# EAGLE design sensor_final_v1 (EAGLE 9.6.2)
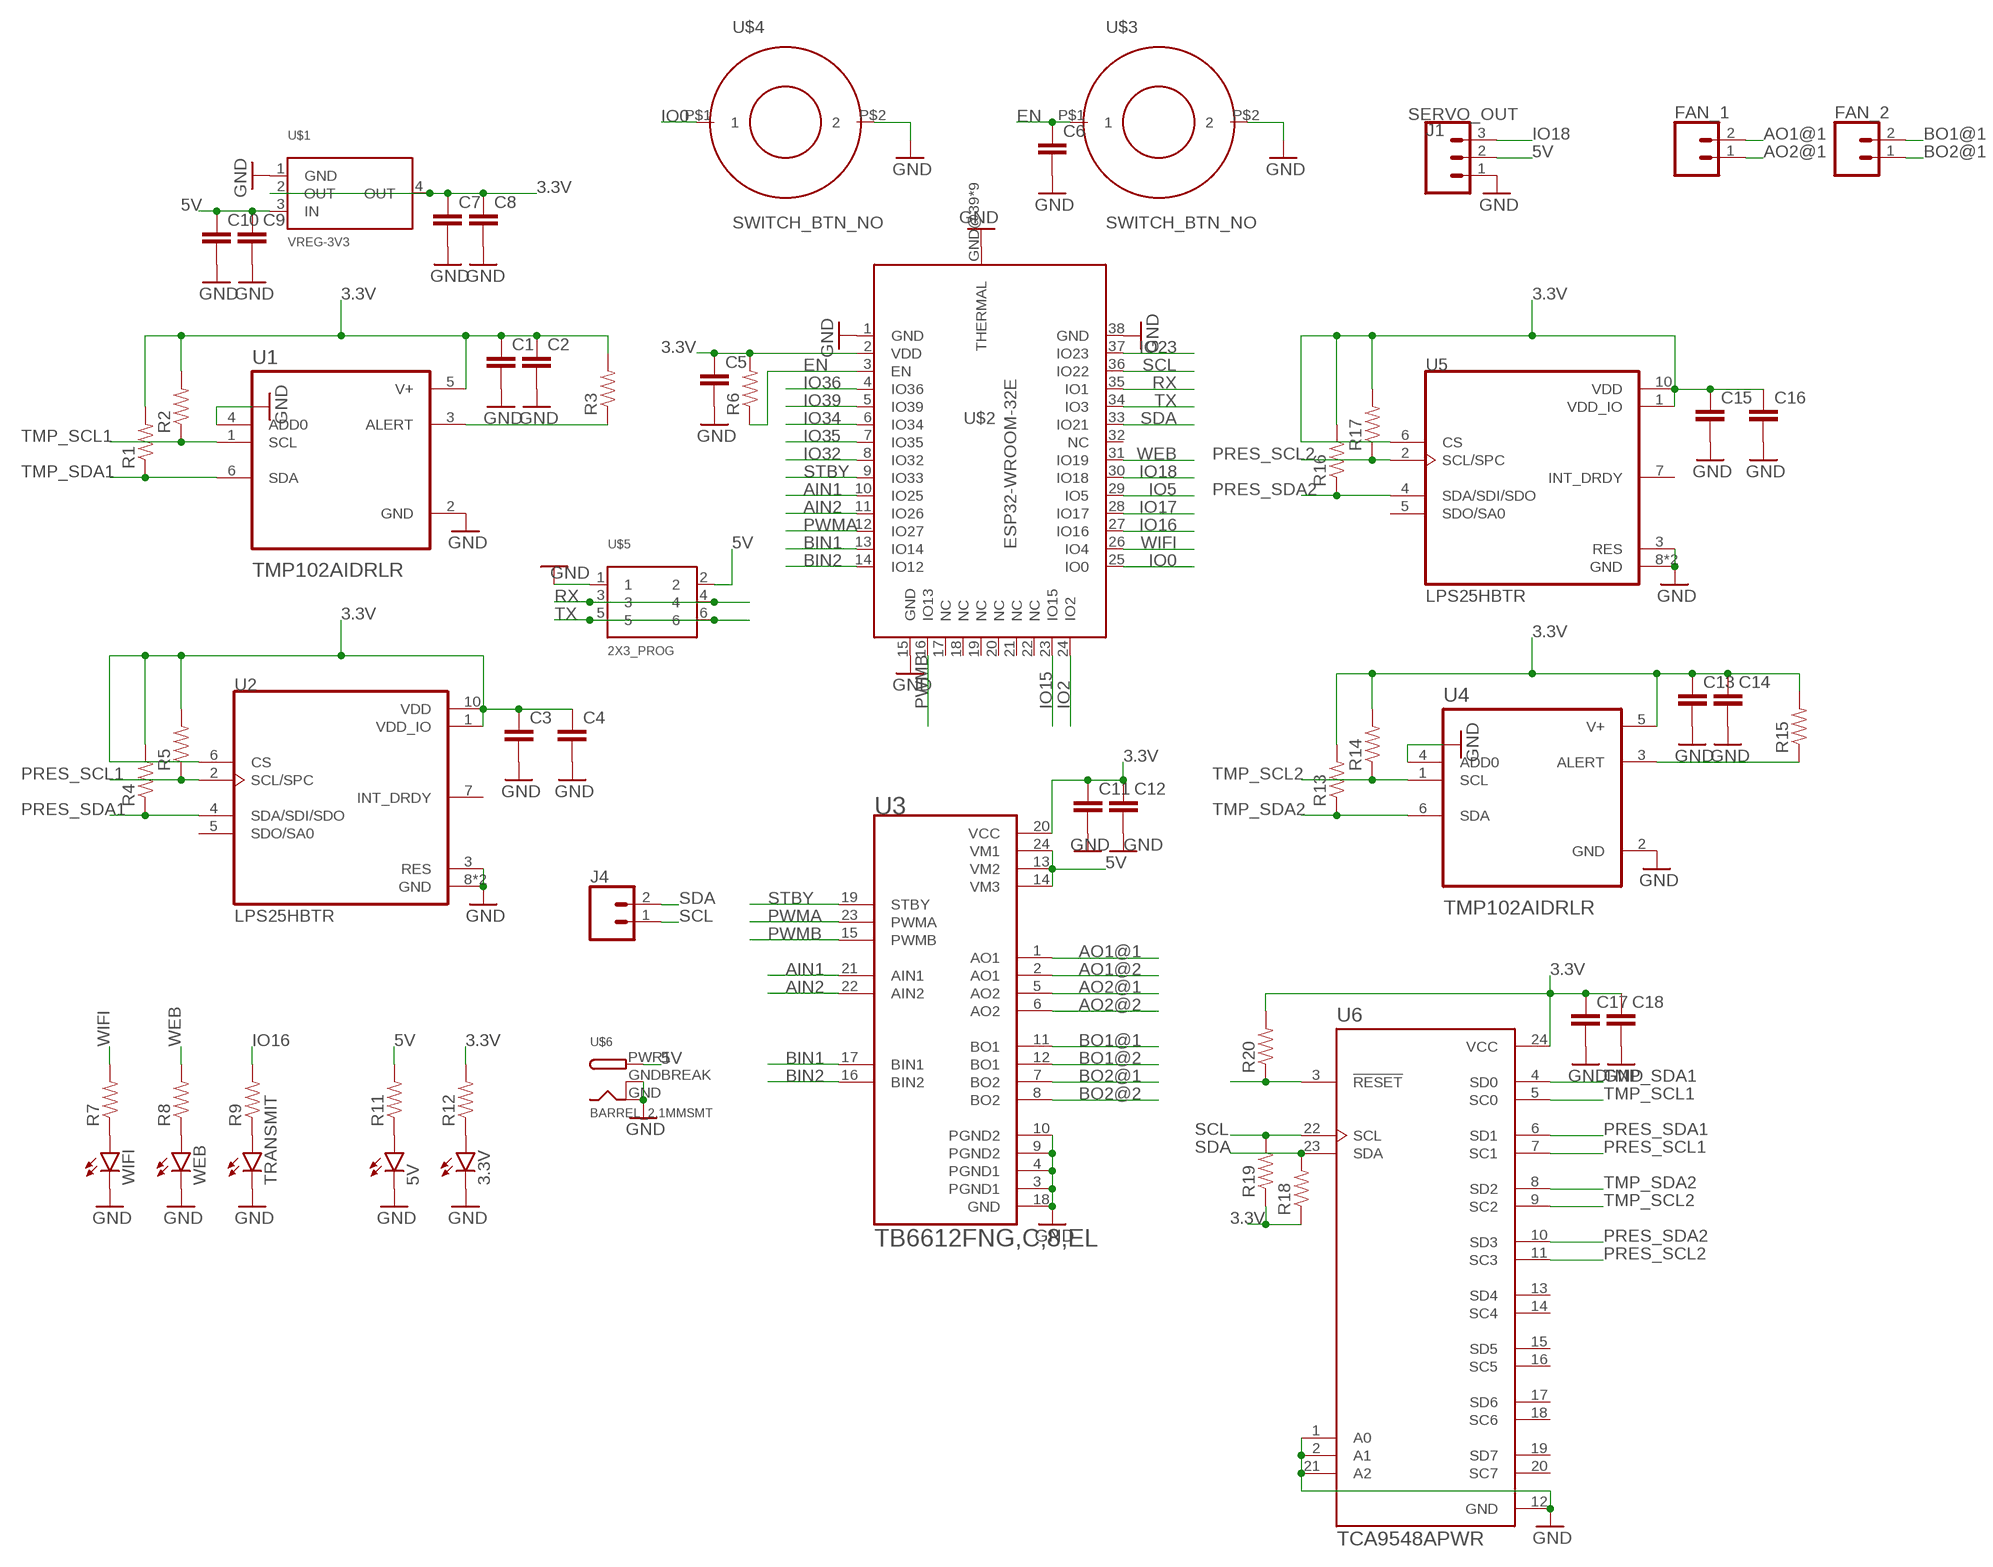
[diagram p0: schematic, sheet 1]

## Parts
3.3V  LEDSMT1206  [1206]
5V  LEDSMT1206  [1206]
C1  CAP  [0805]
C2  CAP  [0805]
C3  CAP  [0805]
C4  CAP  [0805]
C5  CAP  [0805]
C6  CAP  [0805]
C7  CAP  [0805]
C8  CAP  [0805]
C9  CAP  [0805]
C10  CAP  [0805]
C11  CAP  [0805]
C12  CAP  [0805]
C13  CAP  [0805]
C14  CAP  [0805]
C15  CAP  [0805]
C16  CAP  [0805]
C17  CAP  [0805]
C18  CAP  [0805]
FAN_1  CONN_02  [1X02]
FAN_2  CONN_02  [1X02]
J1  SERVO_OUT  CONN_03  [1X03]
J4  CONN_02  [1X02]
R1  RES  [0805]
R2  RES  [0805]
R3  RES  [0805]
R4  RES  [0805]
R5  RES  [0805]
R6  RES  [0805]
R7  RES  [0805]
R8  RES  [0805]
R9  RES  [0805]
R11  RES  [0805]
R12  RES  [0805]
R13  RES  [0805]
R14  RES  [0805]
R15  RES  [0805]
R16  RES  [0805]
R17  RES  [0805]
R18  RES  [0805]
R19  RES  [0805]
R20  RES  [0805]
TRANSMIT  LEDSMT1206  [1206]
U1  TMP102AIDRLR  [SOT50P160X60-6N]
U2  LPS25HBTR  [PQFN60P250X250X80-10N]
U3  TB6612FNG,C,8,EL  [SOP65P760X160-24N]
U4  TMP102AIDRLR  [SOT50P160X60-6N]
U5  LPS25HBTR  [PQFN60P250X250X80-10N]
U6  TCA9548APWR  [SOP65P640X120-24N]
U$1  VREG-3V3  [R-PDSO-G4_TI]
U$2  ESP32-WROOM-32E  [ESP32-WROOM-32E]
U$3  SWITCH_BTN_NO  [BTN_2]
U$4  SWITCH_BTN_NO  [BTN_2]
U$5  2X3_PROG  [2X3_0.1IN]
U$6  BARREL_2.1MMSMT  [DCJACK_2MM_SMT]
WEB  LEDSMT1206  [1206]
WIFI  LEDSMT1206  [1206]

## Nets
3.3V: C1.1 C2.1 C3.1 C4.1 C5.1 C7.1 C8.1 C11.1 C12.1 C13.1 C14.1 C15.1 C16.1 C17.1 C18.1 R1.2 R2.2 R3.2 R4.2 R5.2 R6.2 R12.2 R13.2 R14.2 R15.2 R16.2 R17.2 R18.1 R19.1 R20.2 U1.5(V+) U2.1(VDD_IO) U2.6(CS) U2.10(VDD) U3.20(VCC) U4.5(V+) U5.1(VDD_IO) U5.6(CS) U5.10(VDD) U6.24(VCC) U$1.2(OUT) U$1.4(OUT) U$2.2(VDD)
5V: C9.1 C10.1 J1.2 R11.2 U3.13(VM2) U3.14(VM3) U3.24(VM1) U$1.3(IN) U$5.2 U$6.PWR1(PWR)
AIN1: U3.21(AIN1) U$2.10(IO25)
AIN2: U3.22(AIN2) U$2.11(IO26)
AO1@1: FAN_1.2 U3.1(AO1)
AO1@2: U3.2(AO1)
AO2@1: FAN_1.1 U3.5(AO2)
AO2@2: U3.6(AO2)
BIN1: U3.17(BIN1) U$2.13(IO14)
BIN2: U3.16(BIN2) U$2.14(IO12)
BO1@1: FAN_2.2 U3.11(BO1)
BO1@2: U3.12(BO1)
BO2@1: FAN_2.1 U3.7(BO2)
BO2@2: U3.8(BO2)
EN: C6.1 R6.1 U$2.3(EN) U$3.P$1
GND: 3.3V.C 5V.C C1.2 C2.2 C3.2 C4.2 C5.2 C6.2 C7.2 C8.2 C9.2 C10.2 C11.2 C12.2 C13.2 C14.2 C15.2 C16.2 C17.2 C18.2 J1.1 TRANSMIT.C U1.2(GND) U1.4(ADD0) U2.3(RES) U2.8(GND) U2.9(GND) U3.3(PGND1) U3.4(PGND1) U3.9(PGND2) U3.10(PGND2) U3.18(GND) U4.2(GND) U4.4(ADD0) U5.3(RES) U5.8(GND) U5.9(GND) U6.1(A0) U6.2(A1) U6.12(GND) U6.21(A2) U$1.1(GND) U$2.1(GND) U$2.15(GND) U$2.38(GND) U$2.GND@39(THERMAL) U$2.GND@40(THERMAL) U$2.GND@41(THERMAL) U$2.GND@42(THERMAL) U$2.GND@43(THERMAL) U$2.GND@44(THERMAL) U$2.GND@45(THERMAL) U$2.GND@46(THERMAL) U$2.GND@47(THERMAL) U$3.P$2 U$4.P$2 U$5.1 U$6.GND U$6.GNDBREAK WEB.C WIFI.C
IO0: U$2.25(IO0) U$4.P$1
IO2: U$2.24(IO2)
IO5: U$2.29(IO5)
IO15: U$2.23(IO15)
IO16: R9.2 U$2.27(IO16)
IO17: U$2.28(IO17)
IO18: J1.3 U$2.30(IO18)
IO23: U$2.37(IO23)
IO32: U$2.8(IO32)
IO34: U$2.6(IO34)
IO35: U$2.7(IO35)
IO36: U$2.4(IO36)
IO39: U$2.5(IO39)
N$1: R20.1 U6.3(!RESET)
N$3: R3.1 U1.3(ALERT)
N$7: R7.1 WIFI.A
N$8: R8.1 WEB.A
N$9: R9.1 TRANSMIT.A
N$11: 5V.A R11.1
N$17: 3.3V.A R12.1
N$21: R15.1 U4.3(ALERT)
PRES_SCL1: R5.1 U2.2(SCL/SPC) U6.7(SC1)
PRES_SCL2: R17.1 U5.2(SCL/SPC) U6.11(SC3)
PRES_SDA1: R4.1 U2.4(SDA/SDI/SDO) U6.6(SD1)
PRES_SDA2: R16.1 U5.4(SDA/SDI/SDO) U6.10(SD3)
PWMA: U3.23(PWMA) U$2.12(IO27)
PWMB: U3.15(PWMB) U$2.16(IO13)
RX: U$2.35(IO1) U$5.3 U$5.4
SCL: J4.1 R19.2 U6.22(SCL) U$2.36(IO22)
SDA: J4.2 R18.2 U6.23(SDA) U$2.33(IO21)
STBY: U3.19(STBY) U$2.9(IO33)
TMP_SCL1: R2.1 U1.1(SCL) U6.5(SC0)
TMP_SCL2: R14.1 U4.1(SCL) U6.9(SC2)
TMP_SDA1: R1.1 U1.6(SDA) U6.4(SD0)
TMP_SDA2: R13.1 U4.6(SDA) U6.8(SD2)
TX: U$2.34(IO3) U$5.5 U$5.6
WEB: R8.2 U$2.31(IO19)
WIFI: R7.2 U$2.26(IO4)
Unconnected: U2.5(SDO/SA0) U2.7(INT_DRDY) U5.5(SDO/SA0) U5.7(INT_DRDY) U6.13(SD4) U6.14(SC4) U6.15(SD5) U6.16(SC5) U6.17(SD6) U6.18(SC6) U6.19(SD7) U6.20(SC7) U$2.17(NC) U$2.18(NC) U$2.19(NC) U$2.20(NC) U$2.21(NC) U$2.22(NC) U$2.32(NC)

## Library data of the parts
3.3V 5V TRANSMIT WEB WIFI = led:LED: LED OSRAM: - CHIPLED LG R971, LG N971, LY N971, LG Q971, LY Q971, LO R971, LY R971 LH N974, LH R974 LS Q976, LO Q976, LY Q976 LO Q996 - Hyper CHIPLED LW Q18S LB Q993, LB Q99A, LB R99A - SideLED LS A670, LO A670, LY A670, LG A670, LP A670 LB A673, LV A673, LT A673, LW A673 LH A674 LY A675 LS A676, LA A676, LO A676, LY A676, LW A676 LS A679, LY A679, LG A679 - Hyper Micro SIDELED® LS Y876, LA Y876, LO Y876, LY Y876 LT Y87S - SmartLED LW L88C, LW L88S LB L89C, LB L89S, LG L890 LS L89K, LO L89K, LY L89K LS L896, LA L896, LO L896, LY L896 - TOPLED LS T670, LO T670, LY T670, LG T670, LP T670 LSG T670, LSP T670, LSY T670, LOP T670, LYG T670 LG T671, LOG T671, LSG T671 LB T673, LV T673, LT T673, LW T673 LH T674 LS T676, LA T676, LO T676, LY T676, LB T676, LH T676, LSB T676, LW T676 LB T67C, LV T67C, LT T67C, LS T67K, LO T67K, LY T67K, LW E67C LS E67B, LA E67B, LO E67B, LY E67B, LB E67C, LV E67C, LT E67C LW T67C LS T679, LY T679, LG T679 LS T770, LO T770, LY T770, LG T770, LP T770 LB T773, LV T773, LT T773, LW T773 LH T774 LS E675, LA E675, LY E675, LS T675 LS T776, LA T776, LO T776, LY T776, LB T776 LHGB T686 LT T68C, LB T68C - Hyper Mini TOPLED® LB M676 - Mini TOPLED Santana® LG M470 LS M47K, LO M47K, LY M47K Source: http://www.osram.convergy.de LUXEON: - LUMILED® LXK2-PW12-R00, LXK2-PW12-S00, LXK2-PW14-U00, LXK2-PW14-V00 LXK2-PM12-R00, LXK2-PM12-S00, LXK2-PM14-U00 LXK2-PE12-Q00, LXK2-PE12-R00, LXK2-PE12-S00, LXK2-PE14-T00, LXK2-PE14-U00 LXK2-PB12-K00, LXK2-PB12-L00, LXK2-PB12-M00, LXK2-PB14-N00, LXK2-PB14-P00, LXK2-PB14-Q00 LXK2-PR12-L00, LXK2-PR12-M00, LXK2-PR14-Q00, LXK2-PR14-R00 LXK2-PD12-Q00, LXK2-PD12-R00, LXK2-PD12-S00 LXK2-PH12-R00, LXK2-PH12-S00 LXK2-PL12-P00, LXK2-PL12-Q00, LXK2-PL12-R00 Source: www.luxeon.com KINGBRIGHT: KA-3528ASYC Source: www.kingbright.com
C1-C18 = Ilya_Teach:CAP
FAN_1 FAN_2 J4 = SparkFun-Connectors:CONN_02: Multi connection point. Often used as Generic Header-pin footprint for 0.1 inch spaced/style header connections On any of the 0.1 inch spaced packages, you can populate with these: Break Away Headers - Straight <https://www.sparkfun.com/products/116> (PRT-00116) Break Away Male Headers - Right Angle <https://www.sparkfun.com/products/553> (PRT-00553) Female Headers <https://www.sparkfun.com/products/115> (PRT-00115) Break Away Headers - Machine Pin <https://www.sparkfun.com/products/117> (PRT-00117) Break Away Female Headers - Swiss Machine Pin <https://www.sparkfun.com/products/743> (PRT-00743) For SCREWTERMINALS and SPRING TERMINALS visit here: Screw Terimnals on SparkFun.com <https://www.sparkfun.com/search/results?term=Screw+Terminals> (5mm/3.5mm/2.54mm spacing) This device is also useful as a general connection point to wire up your design to another part of your project. Our various solder wires solder well into these plated through hole pads. Hook-Up Wire - Assortment (Stranded, 22 AWG) <https://www.sparkfun.com/products/11375> (PRT-11375) Hook-Up Wire - Assortment (Solid Core, 22 AWG) <https://www.sparkfun.com/products/11367> (PRT-11367) View the entire wire category on our website here <https://www.sparkfun.com/categories/141> Special notes: Molex polarized connector foot print use with: PRT-08233 with associated crimp pins and housings. 2.54_SCREWTERM for use with PRT-10571. 3.5mm Screw Terminal footprints for PRT-08084 5mm Screw Terminal footprints for use with PRT-08432
J1 = SparkFun-Connectors:CONN_03: Multi connection point. Often used as Generic Header-pin footprint for 0.1 inch spaced/style header connections On any of the 0.1 inch spaced packages, you can populate with these: Break Away Headers - Straight <https://www.sparkfun.com/products/116> (PRT-00116) Break Away Male Headers - Right Angle <https://www.sparkfun.com/products/553> (PRT-00553) Female Headers <https://www.sparkfun.com/products/115> (PRT-00115) Break Away Headers - Machine Pin <https://www.sparkfun.com/products/117> (PRT-00117) Break Away Female Headers - Swiss Machine Pin <https://www.sparkfun.com/products/743> (PRT-00743) Stackable Header - 3 Pin (Female, 0.1") <https://www.sparkfun.com/products/13875> (PRT-13875) For SCREWTERMINALS and SPRING TERMINALS visit here: Screw Terimnals on SparkFun.com <https://www.sparkfun.com/search/results?term=Screw+Terminals> (5mm/3.5mm/2.54mm spacing) This device is also useful as a general connection point to wire up your design to another part of your project. Our various solder wires solder well into these plated through hole pads. Hook-Up Wire - Assortment (Stranded, 22 AWG) <https://www.sparkfun.com/products/11375> (PRT-11375) Hook-Up Wire - Assortment (Solid Core, 22 AWG) <https://www.sparkfun.com/products/11367> (PRT-11367) View the entire wire category on our website here <https://www.sparkfun.com/categories/141> Special notes: Molex polarized connector foot print use with SKU : PRT-08232 with associated crimp pins and housings.; PROD_ID: XXX-00000; VALUE: 455-1750-1-ND
R1-R9 R11-R20 = Ilya_Teach:RES
U1 U4 = TMP102AIDRLR:TMP102AIDRLR: Check availability <https://pricing.snapeda.com/parts/TMP102AIDRLR/Texas%20Instruments/view-part?ref=eda>; AVAILABILITY: In Stock; CHECK_PRICES: https://www.snapeda.com/parts/TMP102AIDRLR/Texas+Instruments/view-part/?ref=eda; DESCRIPTION: 2C digital temperature sensor, I2C/SMBus in 2.56mm2 package; MF: Texas Instruments; MP: TMP102AIDRLR; PACKAGE: SOT-5X3-6 Texas Instruments; PRICE: None; SNAPEDA_LINK: https://www.snapeda.com/parts/TMP102AIDRLR/Texas+Instruments/view-part/?ref=snap
U2 U5 = LPS25HBTR:LPS25HBTR: Check availability <https://pricing.snapeda.com/parts/LPS25HBTR/STMicroelectronics/view-part?ref=eda>; AVAILABILITY: In Stock; CHECK_PRICES: https://www.snapeda.com/parts/LPS25HBTR/STMicroelectronics/view-part/?ref=eda; DESCRIPTION: Pressure Sensor 3.77PSI ~ 18.27PSI (26kPa ~ 126kPa) Absolute - 24 b 10-VFLGA; MF: STMicroelectronics; MP: LPS25HBTR; PACKAGE: VFLGA-10 STMicroelectronics; PRICE: None; SNAPEDA_LINK: https://www.snapeda.com/parts/LPS25HBTR/STMicroelectronics/view-part/?ref=snap
U3 = TB6612FNG_C_8_EL:TB6612FNG,C,8,EL: Check availability <https://pricing.snapeda.com/parts/TB6612FNG%2CC%2C8%2CEL/Toshiba/view-part?ref=eda>; AVAILABILITY: In Stock; CHECK_PRICES: https://www.snapeda.com/parts/TB6612FNG,C,8,EL/Toshiba/view-part/?ref=eda; DESCRIPTION: - Motor Driver Power MOSFET Parallel 24-SSOP; MF: Toshiba; MP: TB6612FNG,C,8,EL; PACKAGE: SSOP-24 Toshiba; PRICE: None; SNAPEDA_LINK: https://www.snapeda.com/parts/TB6612FNG,C,8,EL/Toshiba/view-part/?ref=snap
U6 = TCA9548APWR:TCA9548APWR: Check availability <https://pricing.snapeda.com/parts/TCA9548APWR/Texas%20Instruments/view-part?ref=eda>; AVAILABILITY: In Stock; CHECK_PRICES: https://www.snapeda.com/parts/TCA9548APWR/Texas+Instruments/view-part/?ref=eda; DESCRIPTION: 8-channel 1.65- to 5.5-V I2C/SMBus switch with reset & voltage translation; MF: Texas Instruments; MP: TCA9548APWR; PACKAGE: TSSOP-24 Texas Instruments; PRICE: None; SNAPEDA_LINK: https://www.snapeda.com/parts/TCA9548APWR/Texas+Instruments/view-part/?ref=snap
U$1 = Ilya_Teach:VREG-3V3
U$2 = Ilya_Teach:ESP32-WROOM-32E
U$3 U$4 = Ilya_Teach:SWITCH_BTN_NO
U$5 = Ilya_Teach:2X3_PROG
U$6 = Ilya_Teach:BARREL_2.1MM

## Board
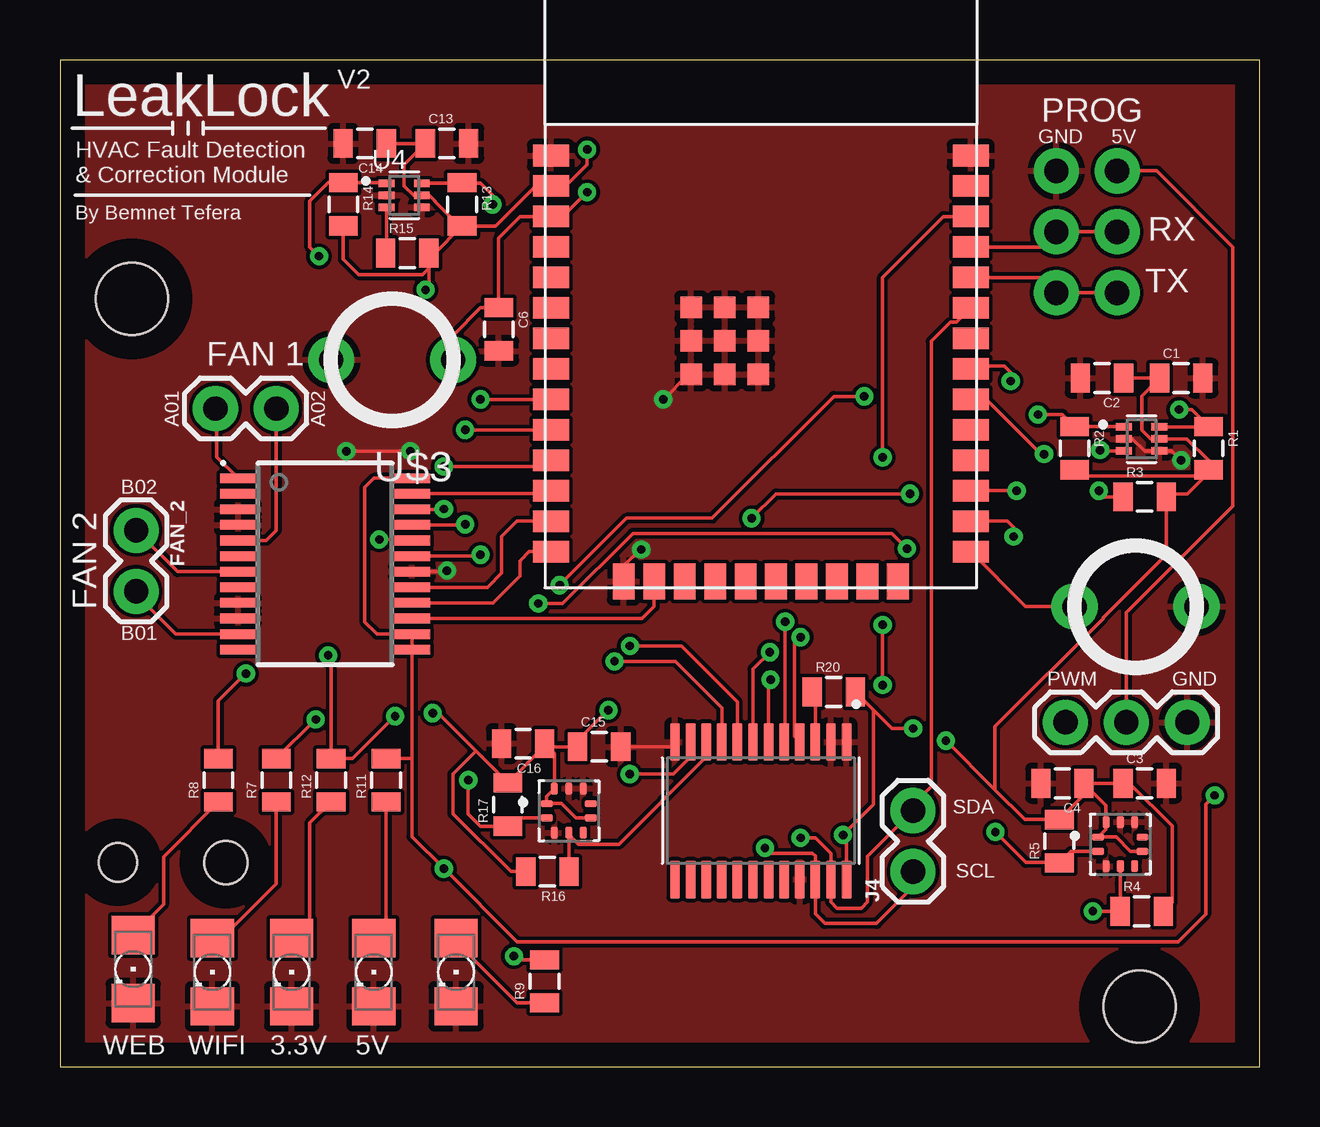
[diagram p1: board, top side]
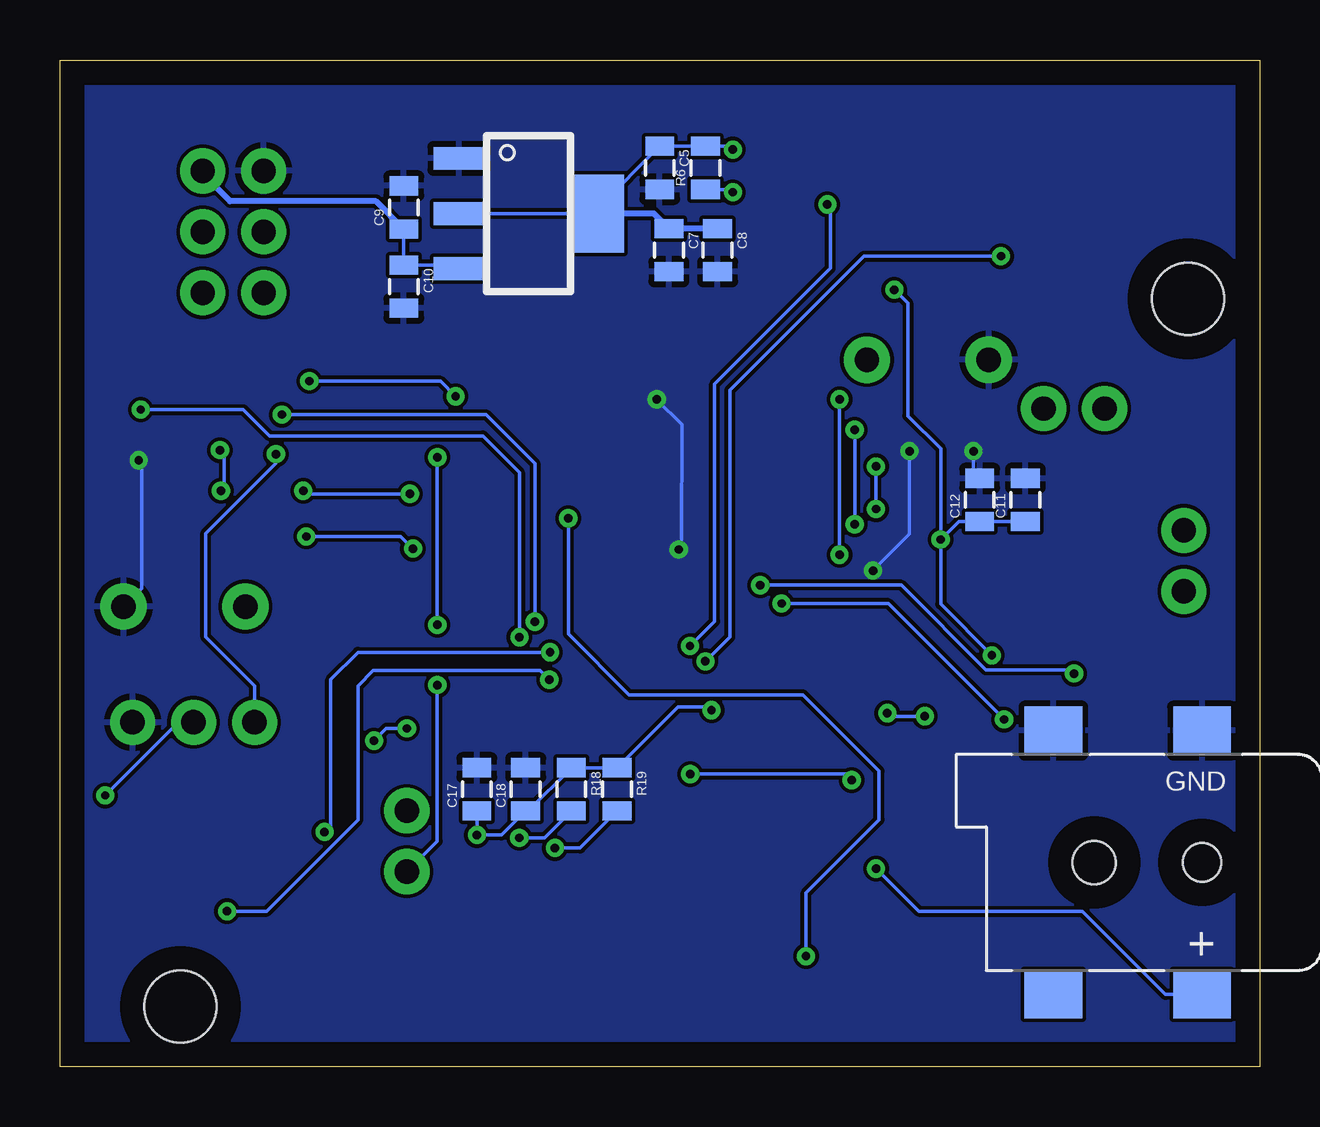
[diagram p2: board, bottom side, seen from below]

Size 50.02 x 41.96 mm. Coordinates in mm from the lower left corner, seen from the top.
Outline: 0,0 50.02,0 50.02,41.96 0,41.96 0,0
Copper layers (1*16): Top 0.035mm / dielectric 1.5mm / Bottom 0.035mm
Design rules "default": minimum track width 6mil, minimum drill 0.35mm, track to track 6mil, track to pad 6mil, pad to pad 6mil, via to via 6mil, smd to smd 6mil, copper to edge 40mil, drill to drill 6mil, minimum pad ring 10mil, minimum via ring 8mil, stop-mask expansion 4mil, vias tented up to drill 0mil, thermal gap 10mil
Holes 3 mm at 3,32 45,2.5

### Footprints (pad centres in the part's own frame; a part is rotated, then mirrored left to right if it is on the bottom)
1206 = smd 1.6 x 1.803: A -1.422,0; C 1.422,0
0805 = smd 0.8 x 1.2: 1 -0.9,0; 2 0.9,0
1X02 = drill 1.016 pad 1.88: 1 0,0; 2 2.54,0
1X03 = drill 1.016 pad 1.88: 1 0,0; 2 2.54,0; 3 5.08,0
SOT50P160X60-6N = smd 0.66 x 0.31: 1 -0.735,0.5; 2 -0.735,0; 3 -0.735,-0.5; 4 0.735,-0.5; 5 0.735,0; 6 0.735,0.5
PQFN60P250X250X80-10N = smd 0.5 x 0.3: 1 -0.92,0.3; 2 -0.92,-0.3; 6 0.92,-0.3; 7 0.92,0.3 | smd 0.3 x 0.5: 3 -0.6,-0.92; 4 0,-0.92; 5 0.6,-0.92; 8 0.6,0.92; 9 0,0.92; 10 -0.6,0.92
SOP65P760X160-24N = smd 1.5 x 0.4: 1 -3.625,3.575; 2 -3.625,2.925; 3 -3.625,2.275; 4 -3.625,1.625; 5 -3.625,0.975; 6 -3.625,0.325; 7 -3.625,-0.325; 8 -3.625,-0.975; 9 -3.625,-1.625; 10 -3.625,-2.275; 11 -3.625,-2.925; 12 -3.625,-3.575; 13 3.625,-3.575; 14 3.625,-2.925; 15 3.625,-2.275; 16 3.625,-1.625; 17 3.625,-0.975; 18 3.625,-0.325; 19 3.625,0.325; 20 3.625,0.975; 21 3.625,1.625; 22 3.625,2.275; 23 3.625,2.925; 24 3.625,3.575
SOP65P640X120-24N = smd 1.57 x 0.41: 1 -2.87,3.575; 2 -2.87,2.925; 3 -2.87,2.275; 4 -2.87,1.625; 5 -2.87,0.975; 6 -2.87,0.325; 7 -2.87,-0.325; 8 -2.87,-0.975; 9 -2.87,-1.625; 10 -2.87,-2.275; 11 -2.87,-2.925; 12 -2.87,-3.575; 13 2.87,-3.575; 14 2.87,-2.925; 15 2.87,-2.275; 16 2.87,-1.625; 17 2.87,-0.975; 18 2.87,-0.325; 19 2.87,0.325; 20 2.87,0.975; 21 2.87,1.625; 22 2.87,2.275; 23 2.87,2.925; 24 2.87,3.575
R-PDSO-G4_TI = smd 0.95 x 2.15: 1 -2.3,-2.9; 2 0,-2.9; 3 2.3,-2.9 | smd 3.25 x 2.15: 4 0,2.9
ESP32-WROOM-32E = smd 1.5 x 0.9: 1 -8.75,8.255; 2 -8.75,6.985; 3 -8.75,5.715; 4 -8.75,4.445; 5 -8.75,3.175; 6 -8.75,1.905; 7 -8.75,0.635; 8 -8.75,-0.635; 9 -8.75,-1.905; 10 -8.75,-3.175; 11 -8.75,-4.445; 12 -8.75,-5.715; 13 -8.75,-6.985; 14 -8.75,-8.255; 25 8.75,-8.255; 26 8.75,-6.985; 27 8.75,-5.715; 28 8.75,-4.445; 29 8.75,-3.175; 30 8.75,-1.905; 31 8.75,-0.635; 32 8.75,0.635; 33 8.75,1.905; 34 8.75,3.175; 35 8.75,4.445; 36 8.75,5.715; 37 8.75,6.985; 38 8.75,8.255 | smd 0.9 x 1.5: 15 -5.715,-9.505; 16 -4.445,-9.505; 17 -3.175,-9.505; 18 -1.905,-9.505; 19 -0.635,-9.505; 20 0.635,-9.505; 21 1.905,-9.505; 22 3.175,-9.505; 23 4.445,-9.505; 24 5.715,-9.505 | smd 0.9 x 0.9: GND@39 -2.9,1.935; GND@40 -1.5,1.935; GND@41 -0.1,1.935; GND@42 -2.9,0.535; GND@43 -1.5,0.535; GND@44 -0.1,0.535; GND@45 -2.9,-0.865; GND@46 -1.5,-0.865; GND@47 -0.1,-0.865
BTN_2 = drill 1.016 pad 1.93: P$1 -2.54,0; P$2 2.54,0
2X3_0.1IN = drill 1.016 pad 1.88: 1 -2.54,-1.27; 2 -2.54,1.27; 3 0,-1.27; 4 0,1.27; 5 2.54,-1.27; 6 2.54,1.27
DCJACK_2MM_SMT = smd 2.4 x 2: GND -2.54,-5.5; GNDBREAK 3.66,-5.5; PWR1 -2.54,5.5; PWR2 3.66,5.5 | hole 1.6: -2.54,0 | hole 1.8: 1.96,0

### Placement (x,y rotation side)
3.3V  9.65,3.94 270 top
5V  13.08,3.94 270 top
C1  46.74,28.7 0 top
C2  43.43,28.7 180 top
C3  45.21,11.81 0 top
C4  41.78,11.81 180 top
C5  25.02,37.47 270 bottom
C6  18.29,30.73 270 top
C7  24.64,34.04 270 bottom
C8  22.61,34.04 270 bottom
C9  35.69,35.81 90 bottom
C10  35.69,32.51 270 bottom
C11  9.78,23.62 90 bottom
C12  11.68,23.62 90 bottom
C13  16.13,38.48 0 top
C14  12.7,38.48 180 top
C15  22.48,13.34 0 top
C16  19.3,13.46 180 top
C17  32.64,11.56 90 bottom
C18  30.61,11.56 90 bottom
FAN_1  9.02,27.43 180 top
FAN_2  3.17,22.35 270 top
J1  46.99,14.35 180 top
J4  35.56,8.13 90 top
R1  47.88,25.78 270 top
R2  42.29,25.78 270 top
R3  45.21,23.75 0 top
R4  45.09,6.48 0 top
R5  41.66,9.4 90 top
R6  23.11,37.47 90 bottom
R7  9.02,11.94 90 top
R8  6.6,11.94 90 top
R9  20.19,3.56 90 top
R11  13.59,11.94 90 top
R12  11.3,11.94 90 top
R13  16.76,35.94 270 top
R14  11.81,35.94 270 top
R15  14.48,33.91 0 top
R16  20.32,8.13 180 top
R17  18.67,10.92 90 top
R18  28.7,11.56 270 bottom
R19  26.8,11.56 270 bottom
R20  32.26,15.62 0 top
TRANSMIT  16.51,3.94 270 top
U1  45.09,26.16 0 top
U2  44.2,9.27 0 top
U3  11.05,20.95 0 top
U4  14.35,36.32 0 top
U5  21.21,10.67 0 top
U6  29.21,10.67 270 top
U$1  30.48,35.56 270 bottom
U$2  29.21,29.72 0 top
U$3  13.84,29.46 180 top
U$4  44.83,19.18 0 top
U$5  42.8,34.8 270 top
U$6  4.95,8.51 180 bottom
WEB  3.05,4.06 270 top
WIFI  6.35,3.94 270 top

### Tracks (layer width: path | path; a pad name or v marks a point on that pad's centre or on a via)
3.3V  (via drill 0.35)
  Top 0.152: U6.24 32.78,9.51 v32.64,9.65 33.91,10.92 33.91,14.87 R20.2 34.68,14.1 v35.56,14.1 | v21.97,38.23 21.97,37.59 21.08,36.7 U$2.2 19.82,36.7 18.16,35.04 R13.2 16.71,34.98 | C2.1 C1.1 45.09,27.95 45.09,26.54 45.47,26.16 U1.5 46.98,26.16 47.88,25.26 R1.2 47.82,24.82 | 47.82,24.82 47.62,24.63 42.55,24.63 R2.2 | C4.1 C3.1 44.58,11.81 46.35,10.03 46.35,6.85 R4.2 | C4.1 43.6,10.9 U2.10 43.6,9.89 U2.1 44.02,9.57 44.62,8.97 U2.6 | C4.1 42.68,11.32 R5.2 40.22,10.3 38.98,11.54 | C16.1 20.2,13.36 R17.2 17.34,13.15 | C16.1 20.61,13.06 U5.10 20.29,11.27 U5.1 20.91,10.97 21.51,10.37 U5.6 | C16.1 20.33,13.34 C15.1 21.58,13.59 v22.85,14.86 v22.86,14.86 | 16.71,34.98 15.63,33.91 R15.2 | C14.1 C13.1 14.35,37.6 14.35,36.7 14.73,36.32 U4.5 15.39,36.32 15.64,36.07 15.64,36.04 16.71,34.98 | R14.2 11.81,33.66 12.45,33.02 15.11,33.02 15.38,33.28 R15.2 | v13.31,21.97 14.63,21.97 U3.20 | v36.93,13.59 38.98,11.54 | R15.2 15.38,32.52 v15.24,32.38 | v11.18,17.14 11.3,17.02 R12.2 12.19,12.84 v13.96,14.61 v13.97,14.61 | 38.98,11.54 38.98,14.17 43.48,18.68 43.48,18.72 46.11,21.35 R3.2 46.24,23.88 46.99,23.88 47.82,24.71 47.82,24.82 | v15.54,14.73 15.76,14.73 17.34,13.15 | R16.2 18.8,8.13 16.38,10.54 16.38,12.19 17.34,13.15
  Bottom 0.152: C17.1 v32.64,9.65 31.61,9.65 C18.1 30.5,10.66 R18.1 R19.1 24.27,14.99 22.99,14.99 v22.86,14.86 | v21.97,38.23 22.11,38.37 R6.2 C5.1 27.58,35.8 U$1.4 U$1.2 | C11.1 C12.1 12.56,22.72 v13.31,21.97 | v35.56,14.1 36.42,14.1 v36.93,13.59 | v15.24,32.38 14.68,31.83 14.68,27.13 13.31,25.75 v13.31,21.97 | v13.31,21.97 13.31,19.28 v11.18,17.14 | v15.54,14.73 15.41,14.61 v13.97,14.61
  Bottom 0.254: C8.1 C7.1 25.26,35.56 U$1.4
5V  (via drill 0.35)
  Top 0.152: U3.24 13.1,24.53 12.7,24.13 12.7,18.54 13.21,18.03 U3.14 U3.13 14.67,12.83 | U$5.2 45.72,37.34 48.9,34.16 48.9,23.37 44.45,18.92 J1.2 | 14.67,12.83 14.67,9.58 v16,8.26 19.05,5.21 46.61,5.21 47.75,6.35 47.75,10.92 v48.13,11.3 | R11.2 14.66,12.84 14.67,12.83
  Bottom 0.152: 33.53,33.41 C10.1 C9.1 | v48.13,11.3 45.09,14.35 J1.2 | U$6.PWR1 3.94,3.01 7.41,6.48 14.22,6.48 v16,8.26
  Bottom 0.254: U$1.3 33.53,33.41 | U$5.2 44.07,37.21 42.93,36.07 36.84,36.07 C9.1
AIN1  (via drill 0.35)
  Top 0.152: U3.21 16.86,22.58 v16.89,22.61 | v16.89,26.54 U$2.10
  Bottom 0.152: v16.89,22.61 v16.89,26.54
AIN2  (via drill 0.35)
  Top 0.152: U3.22 v15.99,23.23 v16,23.24 | v16,25.02 20.21,25.02 U$2.11
  Bottom 0.152: v16,23.24 v16,25.02
AO1@1
  Top 0.152: FAN_1.2 6.54,27.37 6.54,25.42 U3.1
AO2@1
  Top 0.152: FAN_1.1 9.02,22.35 8.6,21.93 U3.5
BIN1
  Top 0.152: U3.17 17.82,19.98 18.41,20.57 18.41,22.1 19.05,22.73 U$2.13
BIN2
  Top 0.152: U3.16 18.06,19.33 19.18,20.45 19.18,21.08 19.56,21.46 U$2.14
BO1@1
  Top 0.152: FAN_2.2 3.56,19.43 3.56,19.3 4.83,18.03 U3.11
BO2@1
  Top 0.152: U3.7 4.9,20.63 FAN_2.1
EN  (via drill 0.35)
  Top 0.152: v21.97,36.45 20.95,35.43 U$2.3 19.18,35.43 18.29,34.54 C6.1 17.54,31.63 16.38,30.48 U$3.P$1
  Bottom 0.152: R6.1 22.09,36.56 v21.97,36.45
GND  (via drill 0.35)
  Top 0.152: U1.2 44.7,26.16 45.21,25.65 U1.4 46.35,25.66 v46.74,25.27 | U3.18 16.09,20.63 v16.13,20.67 | v14.61,25.65 v11.94,25.65 | C15.2 25.43,13.34 U6.12 | U$2.15 23.5,20.89 v24.23,21.55 | v25.15,27.81 26.19,28.85 U$2.GND@45
  Bottom 0.152: v46.74,25.27 46.61,25.15 46.61,19.94 U$4.P$2 | v16.13,20.67 14.61,22.2 v14.61,25.65 | v11.94,25.65 11.94,24.78 C12.2 | v24.23,21.55 24.23,21.81 24.1,21.93 24.09,26.76 v25.15,27.81
  pour Bottom: -2.54,43.18 -2.54,1.27 1.27,-2.54 52.07,-2.54 55.88,1.27 55.88,43.18
  pour Top: -3.81,44.45 -3.81,0 0,-3.81 53.34,-3.81 57.15,0 57.15,44.45
IO0
  Top 0.152: U$4.P$1 40.25,19.18 U$2.25
IO16  (via drill 0.35)
  Top 0.152: R9.2 19.07,4.46 v18.92,4.6 | v28.83,22.86 29.84,23.88 v35.43,23.88 | v39.88,24 U$2.27
  Bottom 0.152: v18.92,4.6 18.92,7.24 15.88,10.29 15.88,12.32 19.05,15.49 26.29,15.49 28.83,18.03 v28.83,22.86 | v35.43,23.88 39.75,23.88 v39.88,24
IO18  (via drill 0.35)
  Top 0.152: v41.02,25.53 40.89,25.53 38.61,27.81 U$2.30
  Bottom 0.152: J1.3 41.91,15.88 43.94,17.91 43.94,22.23 41.02,25.15 v41.02,25.53
N$1
  Top 0.152: R20.1 31.48,15.49 U6.3
N$3  (via drill 0.35)
  Top 0.152: R3.1 43.56,23.75 v43.31,24 | v43.35,25.7 43.39,25.66 U1.3
  Bottom 0.152: v43.31,24 43.18,24.13 43.18,25.53 v43.35,25.7
N$7
  Top 0.152: R7.1 9.02,7.61 6.77,5.36 WIFI.A
N$8
  Top 0.152: WEB.A 4.32,6.76 4.32,8.75 R8.1
N$9
  Top 0.152: TRANSMIT.A 16.51,5.21 19.06,2.66 R9.1
N$11
  Top 0.152: R11.1 13.59,5.87 5V.A
N$17
  Top 0.152: R12.1 10.41,10.15 10.41,6.12 3.3V.A
N$21
  Top 0.152: U4.3 13.62,33.95 R15.1
PRES_SCL1  (via drill 0.35)
  Top 0.152: U2.2 42.13,8.97 R5.1 41.65,8.51 40.26,8.51 v38.99,9.78 | v29.59,17.27 28.89,16.57 U6.7
  Bottom 0.152: v38.99,9.78 38.73,10.03 38.73,16.13 37.59,17.27 v29.59,17.27
PRES_SCL2  (via drill 0.35)
  Top 0.152: U5.2 19.02,10.37 R17.1 17.54,10.02 17.02,10.54 v17.02,11.94 | U6.11 26.2,13.45 26.2,12.81 25.57,12.19 v23.75,12.19
  Bottom 0.152: v23.75,12.19 17.27,12.19 v17.02,11.94
PRES_SDA1  (via drill 0.35)
  Top 0.152: U2.4 44.2,7.63 R4.1 v43.05,6.48 | v29.62,16.13 29.54,16.05 U6.6
  Bottom 0.152: v43.05,6.48 41.4,6.48 37.59,10.29 37.59,15.88 36.96,16.51 30,16.51 v29.62,16.13
PRES_SDA2
  Top 0.152: R16.1 21.21,8.14 21.21,9.65 | 21.21,9.65 U5.4 | U6.10 26.85,13.45 26.85,12.81 23.3,9.27 21.61,9.27 21.23,9.65 21.21,9.65
PWMA
  Top 0.152: U3.23 20.34,23.88 U$2.12
PWMB
  Top 0.152: U3.15 24.27,18.68 24.77,19.18 U$2.16
RX
  Top 0.152: U$5.4 U$5.3 40.89,34.16 U$2.35
SCL  (via drill 0.35)
  Top 0.152: v29.39,9.11 29.61,8.89 31.37,8.89 31.48,8.77 U6.22 31.48,6.36 31.88,5.97 34.04,5.97 35.56,7.49 J4.1 | U$2.36 36.83,35.43 34.29,32.89 v34.29,25.4 | v34.29,15.9 v34.29,18.41
  Bottom 0.152: R19.2 28.34,9.11 v29.39,9.11 | J4.1 34.29,9.4 v34.29,15.9 | v34.29,18.41 v34.29,25.4
SDA  (via drill 0.35)
  Top 0.152: v30.87,9.54 31.49,9.54 32.13,8.89 U6.23 32.13,6.86 32.38,6.6 33.4,6.6 33.66,6.86 33.66,8.76 J4.2 35.56,10.92 36.32,11.68 36.32,30.24 37.12,31.03 37.37,31.03 U$2.33
  Bottom 0.152: R18.2 29.82,9.54 v30.87,9.54
STBY  (via drill 0.35)
  Top 0.152: U3.19 17.47,21.28 v17.53,21.34 | v17.53,27.81 U$2.9
  Bottom 0.152: v17.53,21.34 v17.53,27.81
TMP_SCL1  (via drill 0.35)
  Top 0.152: U1.1 44.33,26.68 R2.1 41.78,27.19 v40.78,27.19 v40.77,27.18 | v30.23,18.54 30.23,13.58 U6.5
  Bottom 0.152: v40.77,27.18 32.26,27.18 30.23,25.15 v30.23,18.54
TMP_SCL2  (via drill 0.35)
  Top 0.152: U4.1 13.6,36.84 R14.1 11.19,36.84 10.41,36.07 10.41,34.16 v10.79,33.78 | U6.9 27.59,14.96 25.65,16.89 v23.11,16.89
  Bottom 0.152: v23.11,16.89 22.1,17.91 22.1,28.19 16.51,33.78 v10.79,33.78
TMP_SDA1  (via drill 0.35)
  Top 0.152: U1.6 47.86,26.66 R1.1 47.17,27.39 v46.65,27.39 | v30.87,17.9 30.85,17.9 30.62,17.66 30.62,13.75 U6.4
  Bottom 0.152: v46.65,27.39 42.37,27.39 41.27,26.29 32.38,26.29 30.87,24.77 v30.87,17.9
TMP_SDA2  (via drill 0.35)
  Top 0.152: U4.6 16.75,36.82 | 16.75,36.82 R13.1 | U6.8 28.23,15.2 25.9,17.53 v23.76,17.53 | v18.03,35.94 18.03,36.32 17.53,36.82 16.75,36.82
  Bottom 0.152: v23.76,17.53 22.73,18.56 22.73,28.45 17.91,33.27 17.91,35.81 v18.03,35.94
TX
  Top 0.152: U$5.6 U$5.5 40.89,32.89 U$2.34
WEB  (via drill 0.35)
  Top 0.152: v7.75,16.38 v7.74,16.39 6.6,15.25 R8.2 | v20.83,20.07 23.62,22.86 27.18,22.86 32.26,27.94 v33.53,27.94 | v39.62,28.57 39.62,28.96 39.37,29.21 38.09,29.21 U$2.31
  Bottom 0.152: v20.83,20.07 14.96,20.07 11.43,16.54 7.9,16.54 v7.75,16.38 | v33.53,27.94 34.16,28.57 v39.62,28.57
WIFI  (via drill 0.35)
  Top 0.152: v10.66,14.47 v10.65,14.47 R7.2 | v19.94,19.3 20.95,19.3 23.88,22.23 34.67,22.23 v35.31,21.59 | v39.75,22.1 39.75,22.48 39.5,22.73 U$2.26
  Bottom 0.152: v10.66,14.47 15.49,19.3 v19.94,19.3 | v35.31,21.59 35.81,22.1 v39.75,22.1

### Text on the board
tPlace: V2 | LeakLock | PROG | GND | 5V | HVAC Fault Detection / & Correction Module | By Bemnet Tefera | RX | TX | FAN 1 | A01 | A02 | B02 | FAN 2 | B01 | PWM | GND | SDA | SCL | WEB | WIFI | 3.3V | 5V